# EAGLE design pulseGeneratorArduinogndplane (EAGLE 7.2.0)
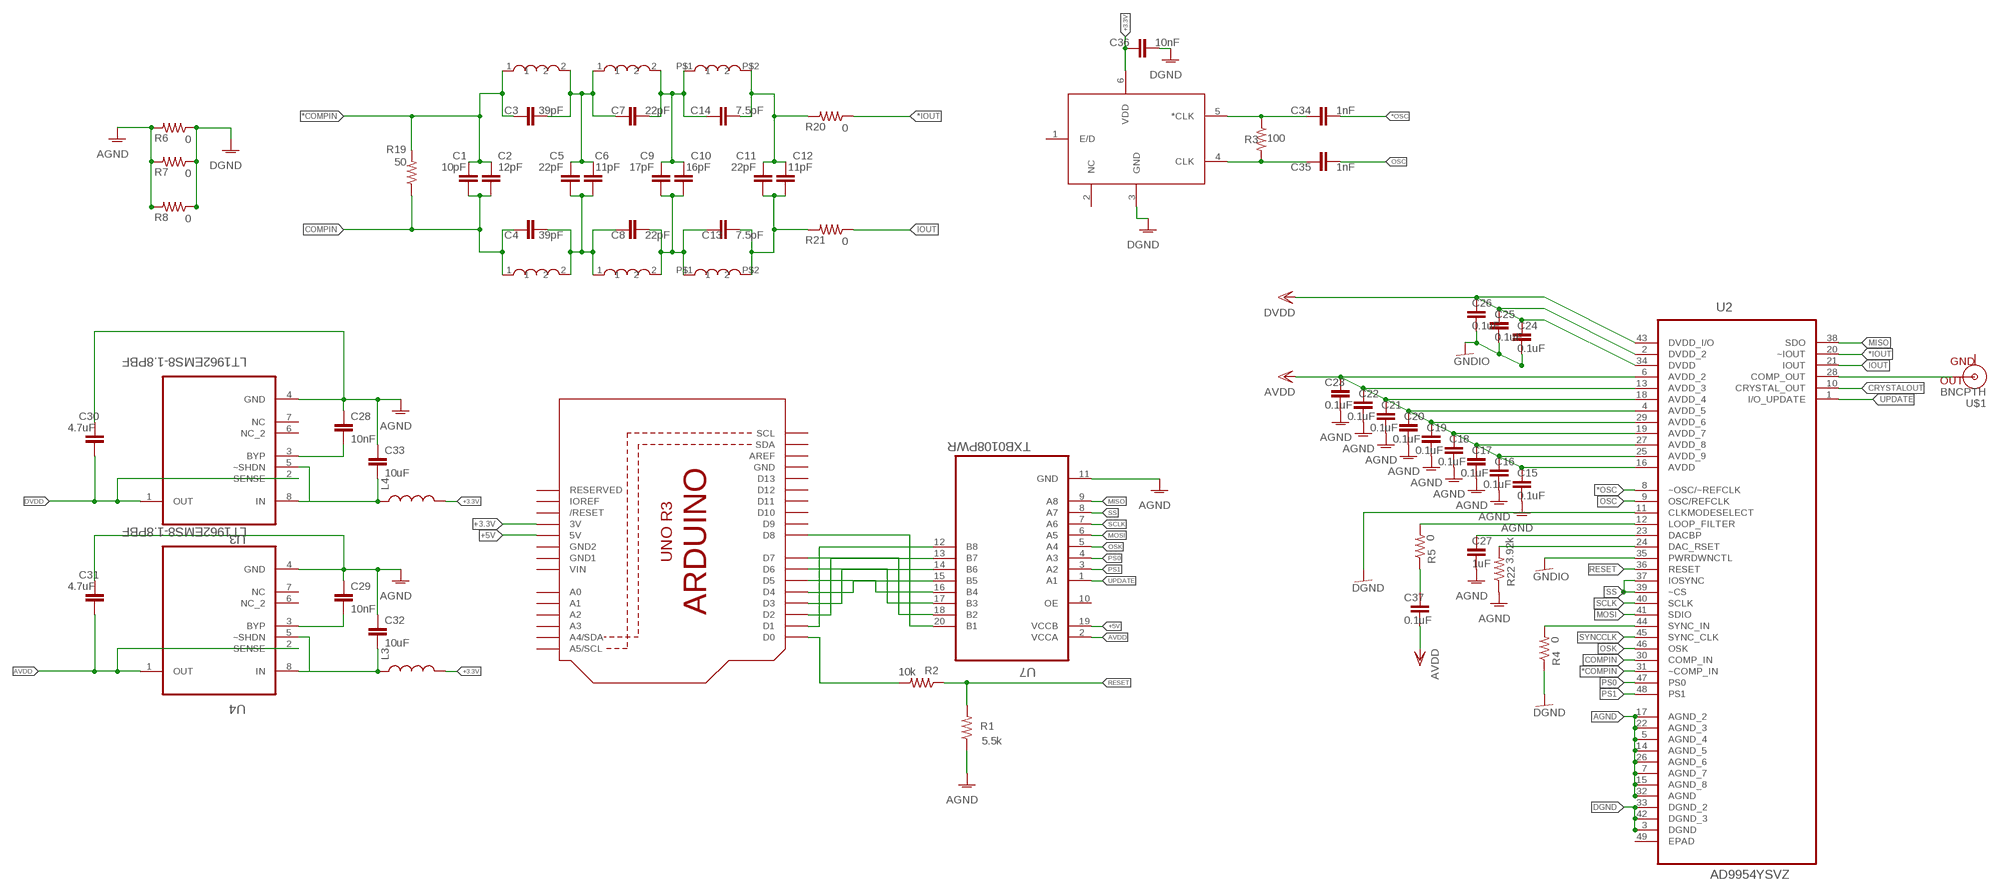
[diagram p0: schematic, sheet 1]

## Parts
C1  10pF  C-EUC0603K  [C0603K]
C2  12pF  C-EUC0603K  [C0603K]
C3  39pF  C-EUC0603K  [C0603K]
C4  39pF  C-EUC0603K  [C0603K]
C5  22pF  C-EUC0603K  [C0603K]
C6  11pF  C-EUC0603K  [C0603K]
C7  22pF  C-EUC0603K  [C0603K]
C8  22pF  C-EUC0603K  [C0603K]
C9  17pF  C-EUC0603K  [C0603K]
C10  16pF  C-EUC0603K  [C0603K]
C11  22pF  C-EUC0603K  [C0603K]
C12  11pF  C-EUC0603K  [C0603K]
C13  7.5pF  C-EUC0603K  [C0603K]
C14  7.5pF  C-EUC0603K  [C0603K]
C15  0.1uF  C-EUC1005  [C1005]
C16  0.1uF  C-EUC1005  [C1005]
C17  0.1uF  C-EUC1005  [C1005]
C18  0.1uF  C-EUC1005  [C1005]
C19  0.1uF  C-EUC1005  [C1005]
C20  0.1uF  C-EUC1005  [C1005]
C21  0.1uF  C-EUC1005  [C1005]
C22  0.1uF  C-EUC1005  [C1005]
C23  0.1uF  C-EUC1005  [C1005]
C24  0.1uF  C-EUC1005  [C1005]
C25  0.1uF  C-EUC1005  [C1005]
C26  0.1uF  C-EUC1005  [C1005]
C27  1uF  C-EUC1005  [C1005]
C28  10nF  C-EUC0603K  [C0603K]
C29  10nF  C-EUC0603K  [C0603K]
C30  4.7uF  C-EUC0603K  [C0603K]
C31  4.7uF  C-EUC0603K  [C0603K]
C32  10uF  C-EUC0603K  [C0603K]
C33  10uF  C-EUC0603K  [C0603K]
C34  1nF  C-EUC0603K  [C0603K]
C35  1nF  C-EUC0603K  [C0603K]
C36  10nF  C-EUC0603K  [C0603K]
C37  0.1uF  C-EUC1005  [C1005]
L3  INDUCTOR0603  [0603]
L4  INDUCTOR0603  [0603]
R1  5.5k  R-US_R0402  [R0402]
R2  10k  R-US_R0402  [R0402]
R3  100  R-US_R0402  [R0402]
R4  0  R-US_R0402  [R0402]
R5  0  R-US_R0402  [R0402]
R6  0  R-US_R0402  [R0402]
R7  0  R-US_R0402  [R0402]
R8  0  R-US_R0402  [R0402]
R19  50  R-US_R0402  [R0402]
R20  0  R-US_R0402  [R0402]
R21  0  R-US_R0402  [R0402]
R22  3.92k  R-US_R0402  [R0402]
U1  ARDUINOR3-DIMENSION  [ARDUINOR3]
U2  AD9954YSVZ  [QFP50P900X900X120-49N]
U3  LT1962EMS8-1.8PBF  [SOP65P490X110-8N]
U4  LT1962EMS8-1.8PBF  [SOP65P490X110-8N]
U7  TXB0108PWR  [SOP65P640X120-20N]
U$1  BNCPTH  [BNC]
U$2  FXO-LC53-100  [6-SMD-NOLEADS]
U$3  1080HQ  [1080]
U$4  1080HQ  [1080]
U$5  1080HQ  [1080]
U$6  1080HQ  [1080]
U$7  0805HQ  [0805]
U$8  0805HQ  [0805]

## Nets
*COMPIN: C1.1 C2.1 C3.1 R19.2 U2.31(~COMP_IN) U$4.1
*IOUT: R20.1 U2.20(~IOUT)
*OSC: C34.1 U2.8(~OSC/~REFCLK)
+3.3V: C32.2 C33.2 C36.2 L3.1 L3.2 L4.1 L4.2 U1.3V U3.5(~SHDN) U3.8(IN) U4.5(~SHDN) U4.8(IN) U$2.6(VDD)
+5V: U1.5V U7.19(VCCB)
AGND: C15.2 C16.2 C17.2 C18.2 C19.2 C20.2 C21.2 C22.2 C23.2 C27.2 C28.1 C29.1 C30.1 C31.1 C32.1 C33.1 R1.1 R6.2 R7.2 R8.2 R22.1 U2.5(AGND_4) U2.7(AGND_7) U2.14(AGND_5) U2.15(AGND_8) U2.17(AGND_2) U2.22(AGND_3) U2.26(AGND_6) U2.32(AGND) U3.4(GND) U4.4(GND) U7.11(GND)
AVDD: C15.1 C16.1 C17.1 C18.1 C19.1 C20.1 C21.1 C22.1 C23.1 C31.2 C37.2 U2.4(AVDD_5) U2.6(AVDD_2) U2.13(AVDD_3) U2.16(AVDD) U2.18(AVDD_4) U2.19(AVDD_7) U2.25(AVDD_9) U2.27(AVDD_8) U2.29(AVDD_6) U4.1(OUT) U4.2(SENSE) U7.2(VCCA)
COMPIN: C1.2 C2.2 C4.1 R19.1 U2.30(COMP_IN) U$3.1
CRYSTALOUT: U2.10(CRYSTAL_OUT)
DGND: C24.2 C25.2 C26.2 C36.1 R4.1 R6.1 R7.1 R8.1 U2.3(DGND) U2.11(CLKMODESELECT) U2.33(DGND_2) U2.35(PWRDWNCTL) U2.42(DGND_3) U$2.3(GND) ; supply symbol labelled GNDIO
DVDD: C24.1 C25.1 C26.1 C30.2 U2.2(DVDD_2) U2.34(DVDD) U2.43(DVDD_I/O) U3.1(OUT) U3.2(SENSE)
IOUT: R21.1 U2.21(IOUT)
MISO: U2.38(SDO) U7.9(A8)
MOSI: U2.41(SDIO) U7.6(A5)
N$1: U2.28(COMP_OUT) U$1.S(OUT)
N$2: R22.2 U2.24(DAC_RSET)
N$4: U1.D8 U7.20(B1)
N$5: U1.D7 U7.18(B2)
N$6: U1.D6 U7.17(B3)
N$7: U1.D5 U7.16(B4)
N$8: U1.D1 U7.12(B8)
N$9: U1.D2 U7.13(B7)
N$10: U1.D3 U7.14(B6)
N$11: U1.D4 U7.15(B5)
N$12: R2.2 U1.D0
N$16: C7.1 C9.2 C10.2 C14.2 U$5.2 U$7.P$1
N$17: C8.1 C9.1 C10.1 C13.2 U$6.2 U$8.P$1
N$20: C3.2 C5.2 C6.2 C7.2 U$4.2 U$5.1
N$21: C27.1 U2.23(DACBP)
N$24: C4.2 C5.1 C6.1 C8.2 U$3.2 U$6.1
N$26: C35.2 R3.2 U$2.4(CLK)
N$27: C29.2 U4.3(BYP)
N$28: C34.2 R3.1 U$2.5(*CLK)
N$29: C28.2 U3.3(BYP)
N$32: R4.2 U2.44(SYNC_IN)
N$33: R5.2 U2.12(LOOP_FILTER)
N$34: C37.1 R5.1
N$35: C11.1 C12.1 C13.1 R21.2 U$8.P$2
N$37: C11.2 C12.2 C14.1 R20.2 U$7.P$2
OSC: C35.1 U2.9(OSC/REFCLK)
OSK: U2.46(OSK) U7.5(A4)
PS0: U2.47(PS0) U7.4(A3)
PS1: U2.48(PS1) U7.3(A2)
RESET: R1.2 R2.1 U2.36(RESET)
SCLK: U2.40(SCLK) U7.7(A6)
SS: U2.37(IOSYNC) U2.39(~CS) U7.8(A7)
SYNCCLK: U2.45(SYNC_CLK)
UPDATE: U2.1(I/O_UPDATE) U7.1(A1)
Unconnected: U1.A0 U1.A1 U1.A2 U1.A3 U1.A4(A4/SDA) U1.A5(A5/SCL) U1.AREF U1.D9 U1.D10 U1.D11 U1.D12 U1.D13 U1.IOREF U1.RESERVED U1.RESET(/RESET) U1.SCL U1.SDA U2.49(EPAD) U3.6(NC_2) U3.7(NC) U4.6(NC_2) U4.7(NC) U7.10(OE) U$1.GND U$2.1(E/D) U$2.2(NC)

## Power pins joined to a net without a drawn wire
GND: U1.GND
GND1: U1.GND1
GND2: U1.GND2
VIN: U1.VIN

## Library data of the parts
C1-C37 = resistor:C-EU: CAPACITOR, European symbol
L3 L4 = SparkFun-Passives:INDUCTOR: Inductors Basic Inductor/Choke - 0603 and 1206. Footprints are not proven and vary greatly between part numbers. SRN6045- 33uH, 20% 1.4A SDR0403-560KL - 56uH, 10%, 500mA RMS/740mA peak
R1-R8 R19-R22 = resistor:R-US_: RESISTOR, American symbol
U1 = adafruit:ARDUINOR3: This is a new object for the new Arduino R3 - with extra pins that you may want to use (such as IOref, and duplicated A4/A5
U2 = Analog Devices_By_element14_Batch_1:AD9954YSVZ: Direct Digital Synthesizer; MPN: AD9954YSVZ; OC_FARNELL: 1581969; OC_NEWARK: 19M8953; PACKAGE: TQFP-48; SUPPLIER: ANALOG DEVICES
U3 U4 = LTC_By_element14_Batch_1:LT1962EMS8-1.8PBF: Micropower LDO Regulators; MPN: LT1962EMS8-1.8#PBF; OC_FARNELL: 1627579; OC_NEWARK: 57M7385; PACKAGE: MSOP-8; SUPPLIER: Linear Technologies
U7 = Texas Instruments_By_element14_Batch_1:TXB0108PWR: 8-BIT BIDIRECTIONAL VOLTAGE-LEVEL TRANSLATOR; MPN: TXB0108PWR; OC_FARNELL: 1494945; OC_NEWARK: 27M1151; PACKAGE: TSSOP-20; SUPPLIER: Texas Instruments
U$1 = SparkFun-Connectors:BNC: BNC Connector, Mouser Part# 5227161
U$2 = FXO-LC53-100:FXO-LC53-100
U$3-U$6 = FXO-LC53-100:1080HQ
U$7 U$8 = FXO-LC53-100:0805HQ

## Board
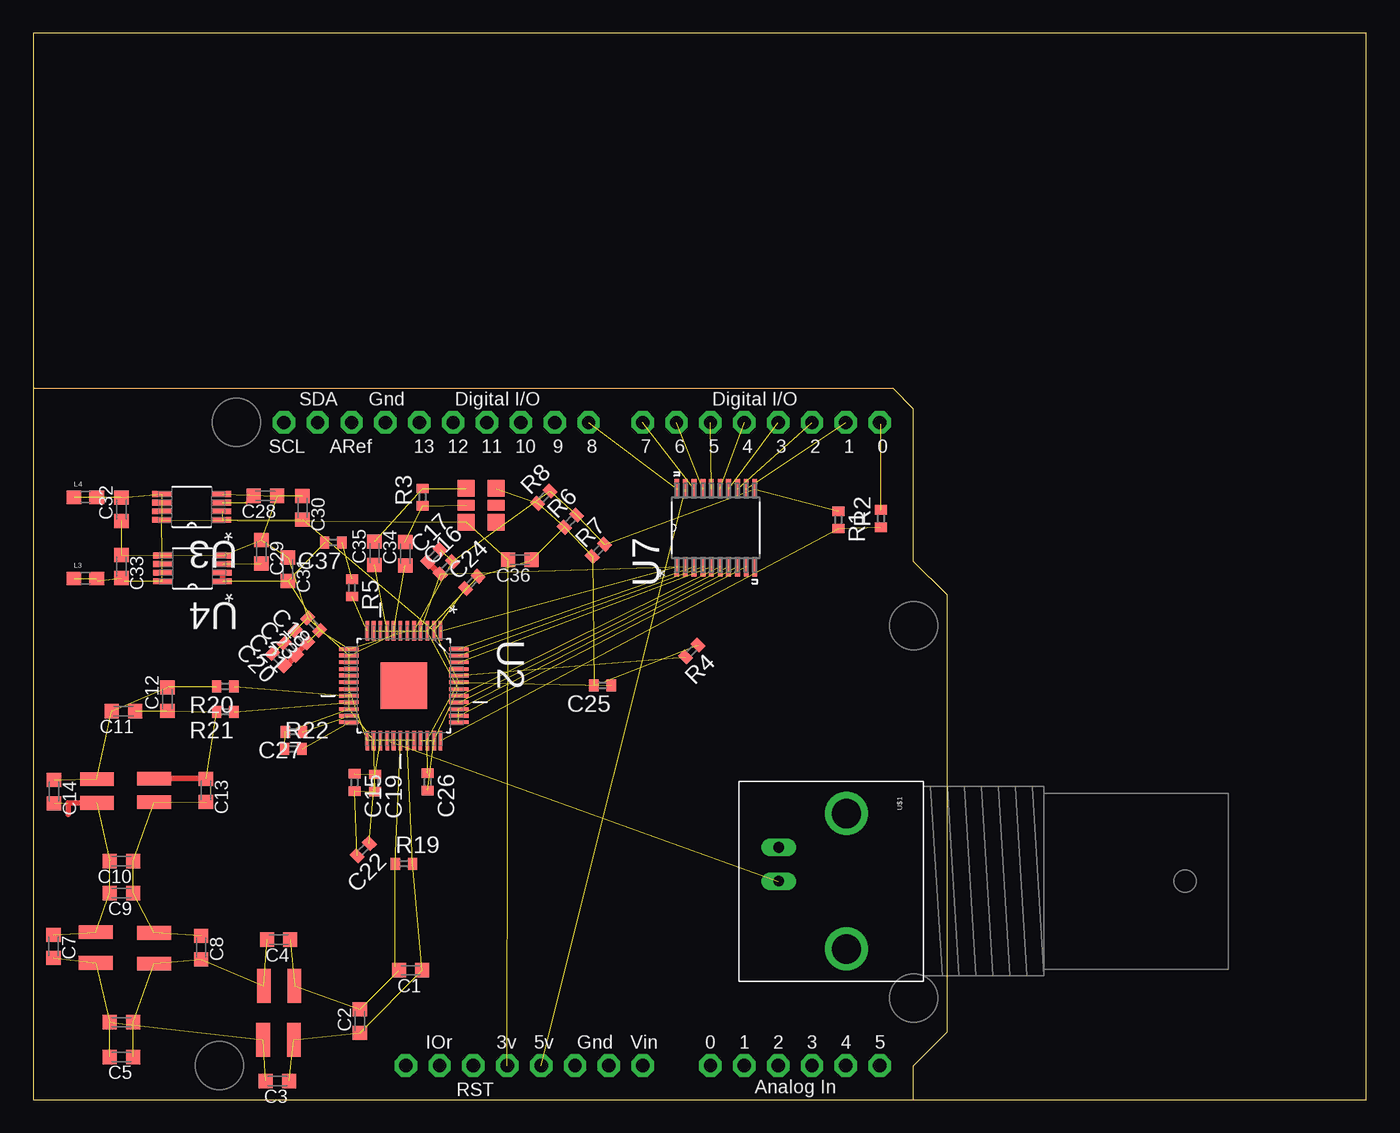
[diagram p1: board, top side]

Size 100 x 80 mm. Coordinates in mm from the lower left corner, seen from the top.
Outline: 0,0 100,0 100,80 0,80 0,0
Copper layers (1*16): Top 0.035mm / dielectric 1.5mm / Bottom 0.035mm
Design rules "default": minimum track width 10mil, minimum drill 24mil, track to track 8mil, track to pad 8mil, pad to pad 8mil, via to via 8mil, smd to smd 8mil, copper to edge 40mil, drill to drill 8mil, minimum pad ring 10mil, minimum via ring 8mil, stop-mask expansion 4mil, vias tented up to drill 0mil, thermal gap 10mil

### Footprints (pad centres in the part's own frame; a part is rotated, then mirrored left to right if it is on the bottom)
C0603K = smd 1.05 x 1.08: 1 -0.875,0; 2 0.875,0
C1005 = smd 0.7 x 0.9: 1 -0.65,0; 2 0.65,0
0603 = smd 1.1 x 1: 1 -0.85,0; 2 0.85,0
R0402 = smd 0.7 x 0.9: 1 -0.65,0; 2 0.65,0
ARDUINOR3 = drill 1 pad 1.676 octagon: 3V 35.56,2.54; 5V 38.1,2.54; A0 50.8,2.54; A1 53.34,2.54; A2 55.88,2.54; A3 58.42,2.54; A4 60.96,2.54; A5 63.5,2.54; AREF 23.876,50.8; D0 63.5,50.8; D1 60.96,50.8; D2 58.42,50.8; D3 55.88,50.8; D4 53.34,50.8; D5 50.8,50.8; D6 48.26,50.8; D7 45.72,50.8; D8 41.656,50.8; D9 39.116,50.8; D10 36.576,50.8; D11 34.036,50.8; D12 31.496,50.8; D13 28.956,50.8; GND 26.416,50.8; GND1 43.18,2.54; GND2 40.64,2.54; IOREF 30.48,2.54; RESERVED 27.94,2.54; RESET 33.02,2.54; SCL 18.796,50.8; SDA 21.336,50.8; VIN 45.72,2.54
QFP50P900X900X120-49N = smd 1.473 x 0.279: 1 -4.115,2.743; 2 -4.115,2.261; 3 -4.115,1.753; 4 -4.115,1.245; 5 -4.115,0.762; 6 -4.115,0.254; 7 -4.115,-0.254; 8 -4.115,-0.762; 9 -4.115,-1.245; 10 -4.115,-1.753; 11 -4.115,-2.261; 12 -4.115,-2.743; 25 4.115,-2.743; 26 4.115,-2.261; 27 4.115,-1.753; 28 4.115,-1.245; 29 4.115,-0.762; 30 4.115,-0.254; 31 4.115,0.254; 32 4.115,0.762; 33 4.115,1.245; 34 4.115,1.753; 35 4.115,2.261; 36 4.115,2.743 | smd 0.279 x 1.473: 13 -2.743,-4.115; 14 -2.261,-4.115; 15 -1.753,-4.115; 16 -1.245,-4.115; 17 -0.762,-4.115; 18 -0.254,-4.115; 19 0.254,-4.115; 20 0.762,-4.115; 21 1.245,-4.115; 22 1.753,-4.115; 23 2.261,-4.115; 24 2.743,-4.115; 37 2.743,4.115; 38 2.261,4.115; 39 1.753,4.115; 40 1.245,4.115; 41 0.762,4.115; 42 0.254,4.115; 43 -0.254,4.115; 44 -0.762,4.115; 45 -1.245,4.115; 46 -1.753,4.115; 47 -2.261,4.115; 48 -2.743,4.115 | smd 3.505 x 3.505: 49 0,0
SOP65P490X110-8N = smd 1.397 x 0.432: 1 -2.261,0.965; 2 -2.261,0.33; 3 -2.261,-0.33; 4 -2.261,-0.965; 5 2.261,-0.965; 6 2.261,-0.33; 7 2.261,0.33; 8 2.261,0.965
SOP65P640X120-20N = smd 1.473 x 0.356: 1 -2.921,2.921; 2 -2.921,2.286; 3 -2.921,1.626; 4 -2.921,0.965; 5 -2.921,0.33; 6 -2.921,-0.33; 7 -2.921,-0.965; 8 -2.921,-1.626; 9 -2.921,-2.286; 10 -2.921,-2.921; 11 2.921,-2.921; 12 2.921,-2.286; 13 2.921,-1.626; 14 2.921,-0.965; 15 2.921,-0.33; 16 2.921,0.33; 17 2.921,0.965; 18 2.921,1.626; 19 2.921,2.286; 20 2.921,2.921
BNC = drill 2.2: 3 -5.08,5.08; 4 5.08,5.08 | drill 0.8 long: GND -2.54,0; S 0,0
6-SMD-NOLEADS = smd 1.24 x 1.29: 1 0.62,0.64; 3 3.16,0.64; 4 3.16,2.89; 6 0.62,2.89 | smd 0.8 x 1.29: 2 1.89,0.64; 5 1.89,2.89
1080 = smd 2.54 x 1.02: 1 1.27,0.51; 2 1.27,2.81
0805 = smd 2.54 x 1.02: P$1 1.27,0.51; P$2 1.27,2.29

### Placement (x,y rotation side)
C1  28.3,9.7 180 top
C2  24.5,5.9 90 top
C3  18.3,1.4 180 top
C4  18.4,12 180 top
C5  6.6,3.2 180 top
C6  6.6,5.8 180 top
C7  1.5,11.5 270 top
C8  12.59,11.39 270 top
C9  6.6,15.5 180 top
C10  6.6,17.9 180 top
C11  6.75,29.15 180 top
C12  10.05,30.05 90 top
C13  12.95,23.2 270 top
C14  1.55,23.1 270 top
C15  24.1,23.8 270 top
C16  31,39.9 45 top
C17  30.05,40.8 45 top
C18  21.03,35.66 135 top
C19  25.65,23.75 270 top
C20  18.4,33 135 top
C21  19.29,33.8 135 top
C22  24.75,18.75 225 top
C23  20.11,34.73 135 top
C24  32.9,38.8 45 top
C25  42.71,31.08 180 top
C26  29.59,23.83 270 top
C27  19.55,27.6 180 top
C28  17.4,45.3 180 top
C29  17.1,41.1 270 top
C30  20.2,44.4 270 top
C31  19.1,39.8 270 top
C32  6.6,44.3 90 top
C33  6.6,40 270 top
C34  27.9,40.95 90 top
C35  25.6,41 90 top
C36  36.5,40.5 180 top
C37  22.5,41.8 180 top
L3  3.9,39.1 0 top
L4  3.9,45.2 0 top
R1  60.4,43.5 270 top
R2  63.6,43.6 90 top
R3  29.2,45.2 90 top
R4  49.4,33.66 225 top
R5  23.9,38.4 270 top
R6  40.3,43.4 45 top
R7  42.4,41.2 45 top
R8  38.3,45.2 45 top
R19  27.8,17.7 0 top
R20  14.4,31 180 top
R21  14.4,29.1 180 top
R22  19.5,26.3 0 top
U1  0,0 0 top
U2  27.8,31.05 270 top
U3  11.89,44.46 180 top
U4  11.94,39.86 180 top
U7  51.2,42.9 90 top
U$1  55.92,16.38 270 top
U$2  35.35,42.7 90 top
U$3  20.1,7.25 90 top
U$4  20.05,3.2 90 top
U$5  3.4,9.75 0 top
U$6  7.8,9.7 0 top
U$7  3.5,21.75 0 top
U$8  7.8,21.8 0 top

### Tracks (layer width: path | path; a pad name or v marks a point on that pad's centre or on a via)
*COMPIN  (5 unrouted)
*IOUT  (1 unrouted)
*OSC  (1 unrouted)
+3.3V  (12 unrouted)
  Top 0.32: L3.2 4.78,38.92 | C33.2 6.83,38.9 | 6.58,45.2 C32.2
+5V  (1 unrouted)
AGND  (31 unrouted)
  pour Top (isolate 0.51, rank 6): 0,0 0,53.3 64.5,53.3 66,51.8 66,40.5 68.6,37.9 68.6,5.1 66,2.5 66,0
  cutout Top (isolate 0.5, rank 6): 0,0 0,53.3 64.5,53.3 66,51.8 66,40.4 68.6,37.8 68.6,5.1 66,2.5 66,0
AVDD  (18 unrouted)
  Top 0.28: C20.1 18.95,32.54 | C21.1 19.75,33.45 | C23.1 | C16.1 30.49,39.44
  Top 0.406: U4.2 U4.1 | 18.95,32.54 C21.1 | 19.75,33.45 C23.1 | 30.49,39.44 C17.1
COMPIN  (5 unrouted)
  Top 0.28: 27.15,9.97 C1.2
DGND  (13 unrouted)
  cutout Top (isolate 0.51, rank 6): 35.9,46.8 35.9,38.7 44.8,38.7 44.9,39.3 37.1,47 36,46.9
DVDD  (8 unrouted)
IOUT  (1 unrouted)
MISO  (1 unrouted)
MOSI  (1 unrouted)
N$1  (1 unrouted)
N$2  (1 unrouted)
N$4  (1 unrouted)
N$5  (1 unrouted)
N$6  (1 unrouted)
N$7  (1 unrouted)
N$8  (1 unrouted)
N$9  (1 unrouted)
N$10  (1 unrouted)
N$11  (1 unrouted)
N$12  (1 unrouted)
  Top 0.28: 63.6,50.7 U1.D0
N$16  (5 unrouted)
  Top 0.28: C14.2 1.45,22.26 | 2.52,21.4 2.6,21.4
  Top 0.406: U$7.P$1 2.6,22.26 2.6,21.4
N$17  (5 unrouted)
N$20  (5 unrouted)
N$21  (1 unrouted)
N$24  (5 unrouted)
N$26  (2 unrouted)
  Top 0.28: U$2.4
N$27  (1 unrouted)
N$28  (2 unrouted)
N$29  (1 unrouted)
  Top 0.28: 16.02,44.79 C28.2
N$32  (1 unrouted)
N$33  (1 unrouted)
N$34  (1 unrouted)
N$35  (3 unrouted)
  Top 0.28: 7.62,29.18 C11.1 7.6,29.15 | C13.1 12.95,24.09
  Top 0.406: 12.95,24.09 U$8.P$2
N$37  (4 unrouted)
  Top 0.28: 10.12,31 C12.2
OSC  (1 unrouted)
OSK  (1 unrouted)
PS0  (1 unrouted)
PS1  (1 unrouted)
RESET  (2 unrouted)
SCLK  (1 unrouted)
SS  (2 unrouted)
  Top 0.28: U2.39
UPDATE  (1 unrouted)